# Altium schematic sheet PicoHAL - w5500.SchDoc: RP2040 CNC
size C; Author: AM; CompanyName: Expatria Technologies; DrawnBy: A.Marles; Engineer: AM; Organization: Expatria Technolgoies; Address1: Schematic; DocumentNumber: 2; SheetNumber: 2; SheetTotal: 8
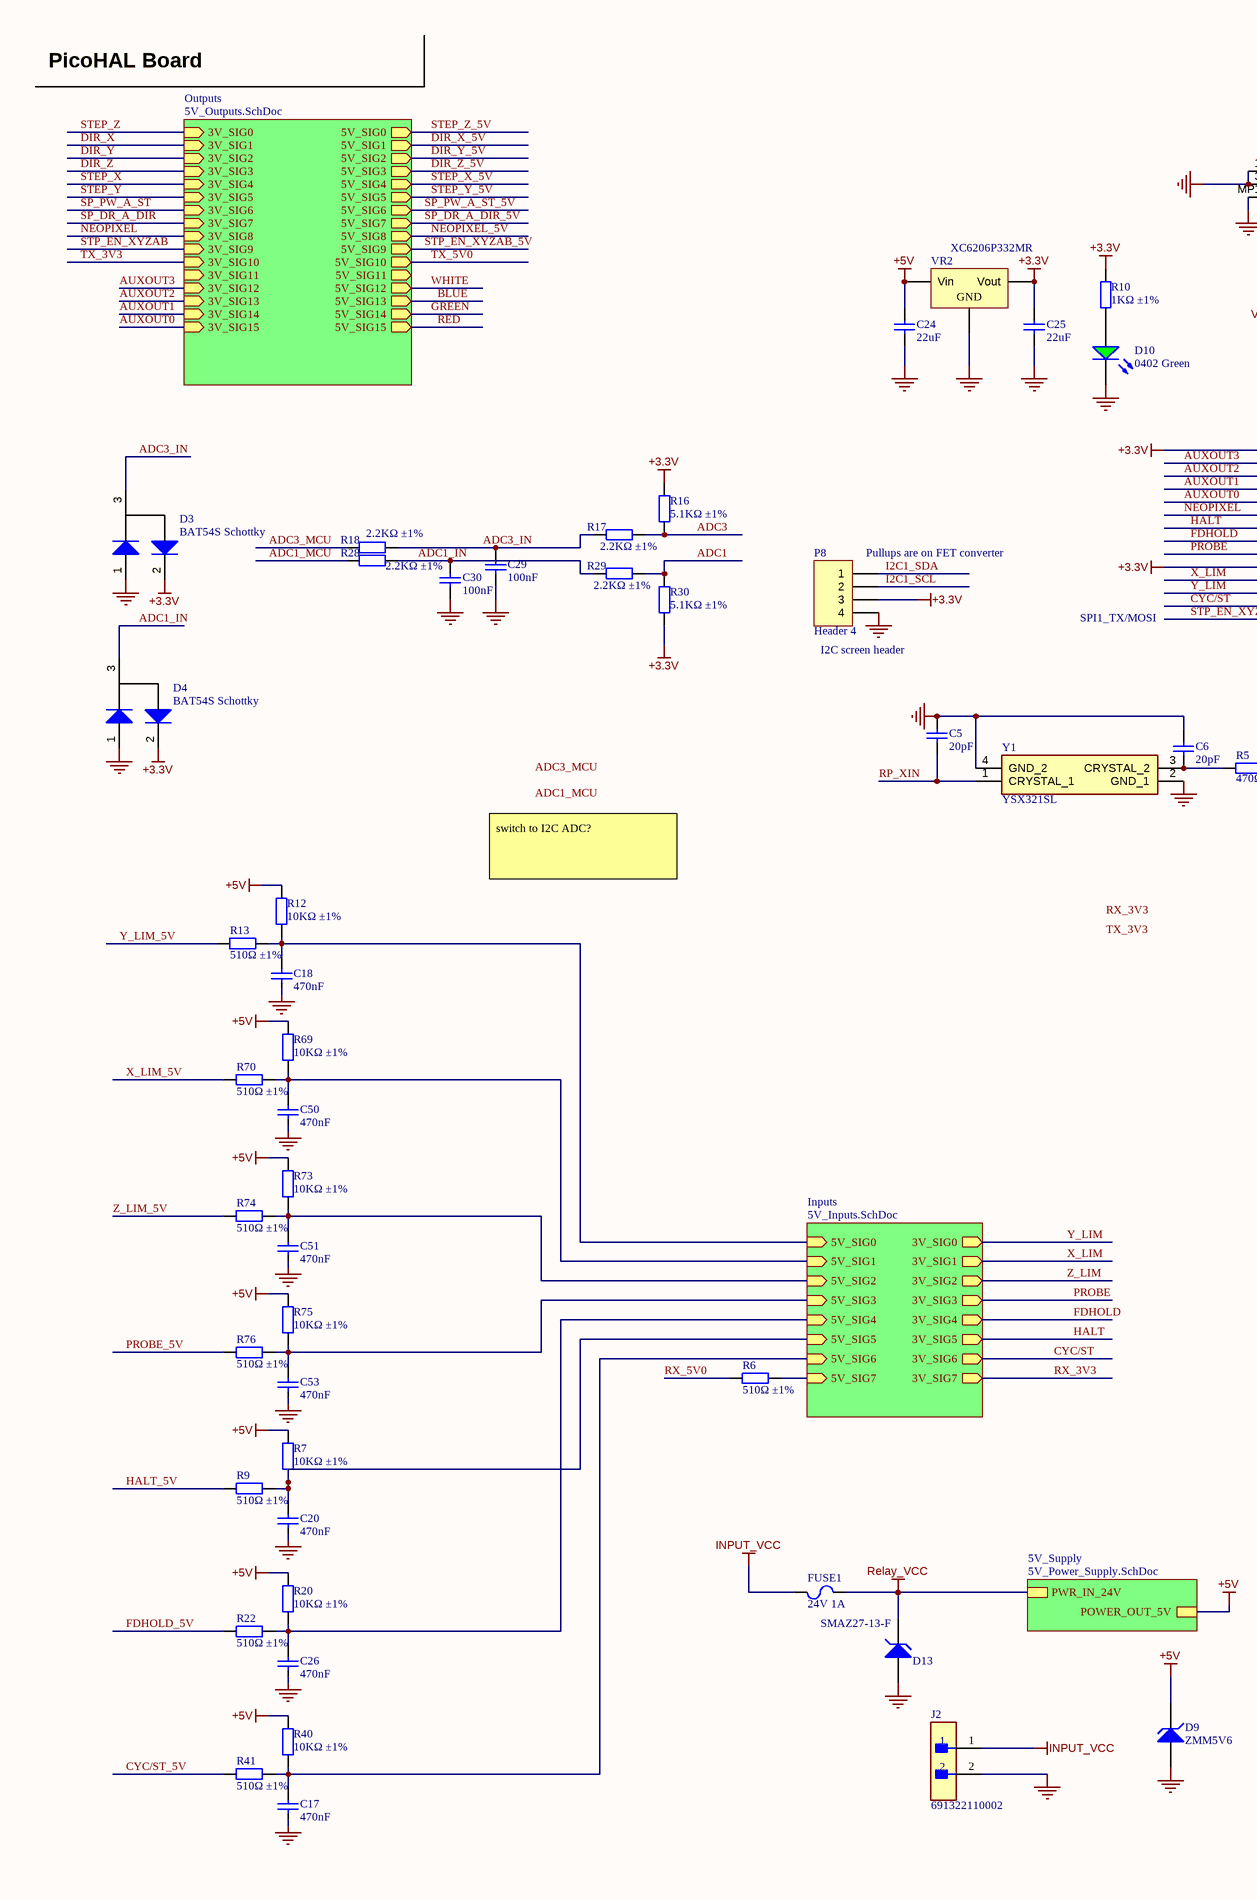
[diagram p0: PicoHAL - w5500.SchDoc, left]
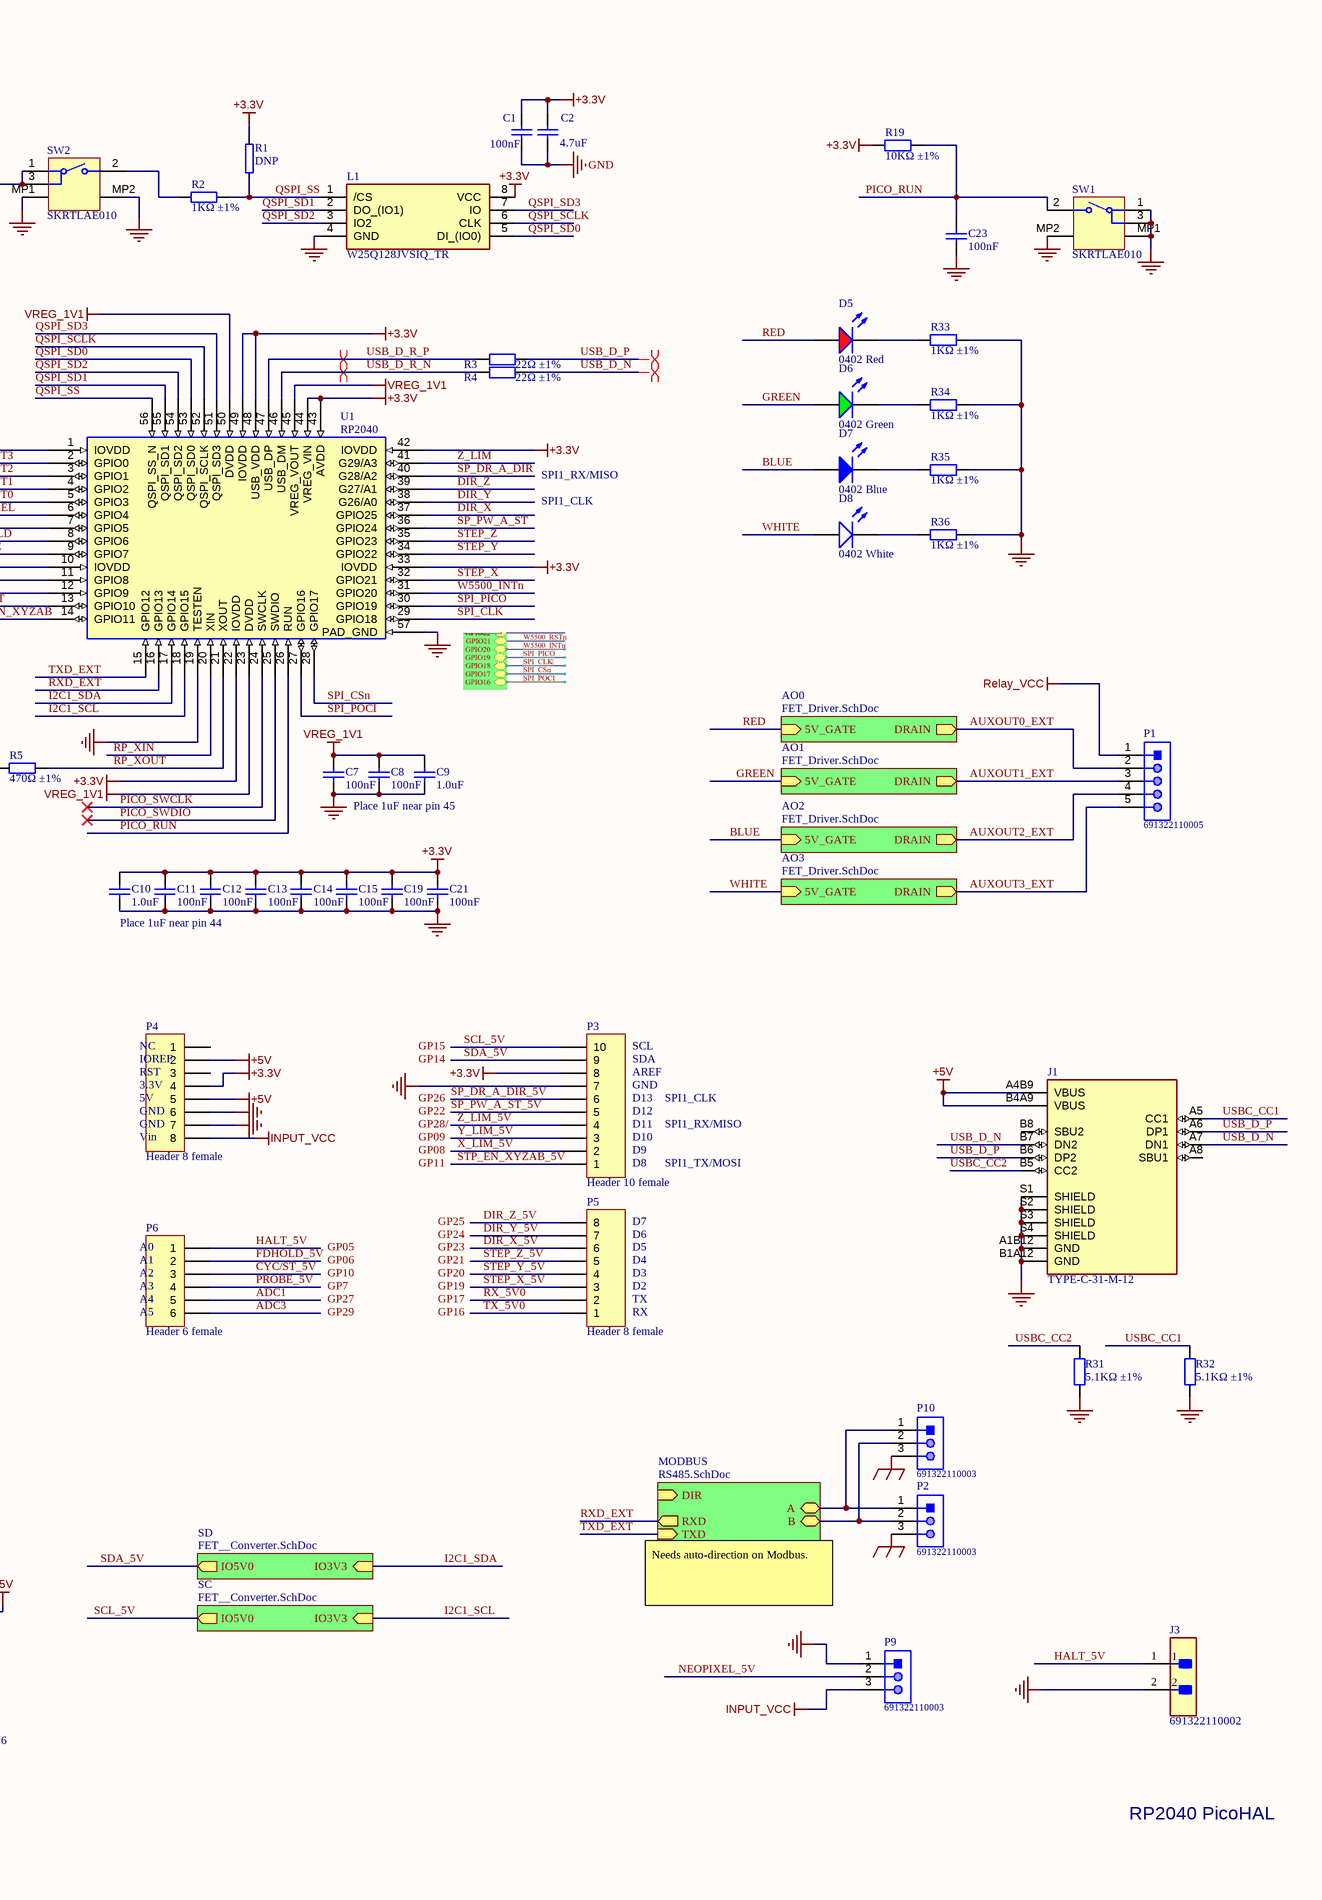
[diagram p1: PicoHAL - w5500.SchDoc, right]

## Parts
C1  100nF  [0402_C]
C2  4.7uF  [0402_C]
C5  20pF  [0402_C]
C6  20pF  [0402_C]
C7  100nF  [0402_C]
C8  100nF  [0402_C]
C9  1.0uF  [0402_C]
C10  1.0uF  [0402_C]
C11  100nF  [0402_C]
C12  100nF  [0402_C]
C13  100nF  [0402_C]
C14  100nF  [0402_C]
C15  100nF  [0402_C]
C17  470nF  [0402_C]
C18  470nF  [0402_C]
C19  100nF  [0402_C]
C20  470nF  [0402_C]
C21  100nF  [0402_C]
C23  100nF  [0402_C]
C24  22uF  [0805_C]
C25  22uF  [0805_C]
C26  470nF  [0402_C]
C29  100nF  [0402_C]
C30  100nF  [0402_C]
C50  470nF  [0402_C]
C51  470nF  [0402_C]
C53  470nF  [0402_C]
D3  BAT54S Schottky  [SOT-23(SOT-23-3)]
D4  BAT54S Schottky  [SOT-23(SOT-23-3)]
D5  0402 Red  [LED 0402_1005 RED]
D6  0402 Green  [LED 0402_1005 RED]
D7  0402 Blue  [LED 0402_1005 RED]
D8  0402 White  [LED 0402_1005 RED]
D9  ZMM5V6  [LL-34]
D10  0402 Green  [LED 0402_1005 RED]
D13  SMAZ27-13-F  [DIOM5226X240N]
FUSE1  24V 1A  [1206_C]
J1  TYPE-C-31-M-12  [HRO_TYPE-C-31-M-12]
J2  691322110002  [FP-691322110002-MFG]
J3  691322110002  [FP-691322110002-MFG]
L1  W25Q128JVSIQ_TR  [SOIC127P780X195-8N]
P1  691322110005  [691322110005]
P2  691322110003  [691322110003]
P3  Header 10 female  [HDR1X10]
P4  Header 8 female  [HDR1X8]
P5  Header 8 female  [HDR1X8]
P6  Header 6 female  [HDR1X6]
P8  Header 4  [HDR1X4]
P9  691322110003  [691322110003]
P10  691322110003  [691322110003]
R1  DNP  [0402]
R2  1KΩ ±1%  [0402_R]
R3  22Ω ±1%  [0402_R]
R4  22Ω ±1%  [0402_R]
R5  470Ω ±1%  [0402_R]
R6  510Ω ±1%  [0402_R]
R7  10KΩ ±1%  [0402_R]
R9  510Ω ±1%  [0402_R]
R10  1KΩ ±1%  [0402_R]
R12  10KΩ ±1%  [0402_R]
R13  510Ω ±1%  [0402_R]
R16  5.1KΩ ±1%  [0402_R]
R17  2.2KΩ ±1%  [0402_R]
R18  2.2KΩ ±1%  [0402_R]
R19  10KΩ ±1%  [0402_R]
R20  10KΩ ±1%  [0402_R]
R22  510Ω ±1%  [0402_R]
R28  2.2KΩ ±1%  [0402_R]
R29  2.2KΩ ±1%  [0402_R]
R30  5.1KΩ ±1%  [0402_R]
R31  5.1KΩ ±1%  [0402_R]
R32  5.1KΩ ±1%  [0402_R]
R33  1KΩ ±1%  [0402_R]
R34  1KΩ ±1%  [0402_R]
R35  1KΩ ±1%  [0402_R]
R36  1KΩ ±1%  [0402_R]
R40  10KΩ ±1%  [0402_R]
R41  510Ω ±1%  [0402_R]
R69  10KΩ ±1%  [0402_R]
R70  510Ω ±1%  [0402_R]
R73  10KΩ ±1%  [0402_R]
R74  510Ω ±1%  [0402_R]
R75  10KΩ ±1%  [0402_R]
R76  510Ω ±1%  [0402_R]
SW1  SKRTLAE010  [ALPS-SKRTLAE010_V]
SW2  SKRTLAE010  [ALPS-SKRTLAE010_V]
U1  RP2040  [RP2040]
VR2  XC6206P332MR  [SOT-23-3L]
Y1  YSX321SL  [YSX321SL]

## Sub-sheets
5V_Supply = 5V_Power_Supply.SchDoc: POWER_OUT_5V, PWR_IN_24V
AO0 = FET_Driver.SchDoc: DRAIN (out), 5V_GATE (in)
AO1 = FET_Driver.SchDoc: DRAIN (out), 5V_GATE (in)
AO2 = FET_Driver.SchDoc: DRAIN (out), 5V_GATE (in)
AO3 = FET_Driver.SchDoc: DRAIN (out), 5V_GATE (in)
Inputs = 5V_Inputs.SchDoc: 5V_SIG5 (in), 5V_SIG1 (in), 3V_SIG3 (out), 3V_SIG6 (out), 3V_SIG1 (out), 5V_SIG6 (in), 3V_SIG0 (out), 3V_SIG5 (out), 3V_SIG2 (out), 3V_SIG4 (out), 5V_SIG3 (in), 3V_SIG7 (out), 5V_SIG2 (in), 5V_SIG4 (in), 5V_SIG0 (in), 5V_SIG7 (in)
MODBUS = RS485.SchDoc: A (bidir), B (bidir), RXD (out), TXD (in), DIR (in)
Outputs = 5V_Outputs.SchDoc: 3V_SIG0 (in), 3V_SIG2 (in), 3V_SIG5 (in), 5V_SIG0 (out), 5V_SIG3 (out), 5V_SIG4 (out), 3V_SIG4 (in), 3V_SIG11 (in), 5V_SIG9 (out), 5V_SIG6 (out), 5V_SIG2 (out), 5V_SIG1 (out), 5V_SIG11 (out), 3V_SIG1 (in), 3V_SIG3 (in), 3V_SIG8 (in), 3V_SIG9 (in), 5V_SIG10 (out), 3V_SIG6 (in), 5V_SIG8 (out), 3V_SIG10 (in), 5V_SIG7 (out), 5V_SIG5 (out), 3V_SIG7 (in), 3V_SIG12 (in), 3V_SIG15 (in), 5V_SIG13 (out), 5V_SIG14 (out), 3V_SIG13 (in), 5V_SIG12 (out), 5V_SIG15 (out), 3V_SIG14 (in)
SC = FET__Converter.SchDoc: IO5V0 (out), IO3V3 (in)
SD = FET__Converter.SchDoc: IO5V0 (out), IO3V3 (in)

## Nets
+3.3V: C1.2 C2.2 C10.2 C11.2 C12.2 C13.2 C14.2 C15.2 C19.2 C21.2 C25.2 D3.2(A) D4.2(A) L1.8(VCC) P3.8 P4.4 P8.3 R1.2 R10.2 R16.1 R19.2 R30.2 U1.1(IOVDD) U1.10(IOVDD) U1.22(IOVDD) U1.33(IOVDD) U1.42(IOVDD) U1.43(AVDD) U1.44(VREG_VIN) U1.48(USB_VDD) U1.49(IOVDD) VR2.2(Vout)
+5V: C24.2 D9.2(K) J1.A4B9(VBUS) J1.B4A9(VBUS) P4.2 P4.5 R7.2 R12.2 R20.2 R40.2 R69.2 R73.2 R75.2 VR2.3(Vin) ; sheet 5V_Supply/POWER_OUT_5V
GND: C1.1 C2.1 C5.2 C6.2 C7.1 C8.1 C9.1 C10.1 C11.1 C12.1 C13.1 C14.1 C15.1 C17.1 C18.1 C19.1 C20.1 C21.1 C23.1 C24.1 C25.1 C26.1 C29.1 C30.1 C50.1 C51.1 C53.1 D3.1(A) D4.1(A) D9.1(A) D10.K D13.1(A) J1.A1B12(GND) J1.B1A12(GND) J1.S1(SHIELD) J1.S2(SHIELD) J1.S3(SHIELD) J1.S4(SHIELD) J2.2 J3.2 L1.4(GND) P3.7 P4.6 P4.7 P8.4 P9.1 R31.2 R32.2 R33.2 R34.2 R35.2 R36.2 SW1.1 SW1.3 SW1.MP1 SW1.MP2 SW2.1 SW2.3 SW2.MP1 SW2.MP2 U1.19(TESTEN) U1.57(PAD_GND) VR2.1(GND) Y1.2(GND_1) Y1.4(GND_2)
INPUT_VCC: FUSE1.1 J2.1 P4.8 P9.3
MOD_GND: P2.3 P10.3
Relay_VCC: D13.2(K) FUSE1.2 P1.1 ; sheet 5V_Supply/PWR_IN_24V
VREG_1V1: C7.2 C8.2 C9.2 U1.23(DVDD) U1.45(VREG_VOUT) U1.50(DVDD)
ADC1: P6.5 R29.2 R30.1
ADC1_IN: C30.2 D4.3(K) R28.2 R29.1
ADC1_MCU: R28.1
ADC3: P6.6 R16.2 R17.2
ADC3_IN: C29.2 D3.3(K) R17.1 R18.2
ADC3_MCU: R18.1
AUXOUT0: U1.5(GPIO3) ; sheet Outputs/3V_SIG15
AUXOUT0_EXT: P1.2 ; sheet AO0/DRAIN
AUXOUT1: U1.4(GPIO2) ; sheet Outputs/3V_SIG14
AUXOUT1_EXT: P1.3 ; sheet AO1/DRAIN
AUXOUT2: U1.3(GPIO1) ; sheet Outputs/3V_SIG13
AUXOUT2_EXT: P1.4 ; sheet AO2/DRAIN
AUXOUT3: U1.2(GPIO0) ; sheet Outputs/3V_SIG12
AUXOUT3_EXT: P1.5 ; sheet AO3/DRAIN
BLUE: D7.A ; sheet Outputs/5V_SIG13, sheet AO2/5V_GATE
CYC/ST: U1.13(GPIO10) ; sheet Inputs/3V_SIG6
CYC/ST_5V: P6.3 R41.1
DIR_X: U1.37(GPIO25) ; sheet Outputs/3V_SIG1
DIR_X_5V: P5.6 ; sheet Outputs/5V_SIG1
DIR_Y: U1.38(G26/A0) ; sheet Outputs/3V_SIG2
DIR_Y_5V: P5.7 ; sheet Outputs/5V_SIG2
DIR_Z: U1.39(G27/A1) ; sheet Outputs/3V_SIG3
DIR_Z_5V: P5.8 ; sheet Outputs/5V_SIG3
FDHOLD: U1.8(GPIO6) ; sheet Inputs/3V_SIG4
FDHOLD_5V: P6.2 R22.1
GREEN: D6.A ; sheet Outputs/5V_SIG14, sheet AO1/5V_GATE
HALT: U1.7(GPIO5) ; sheet Inputs/3V_SIG5
HALT_5V: J3.1 P6.1 R9.1
I2C1_SCL: P8.2 U1.18(GPIO15) ; sheet SC/IO3V3
I2C1_SDA: P8.1 U1.17(GPIO14) ; sheet SD/IO3V3
NEOPIXEL: U1.6(GPIO4) ; sheet Outputs/3V_SIG8
NEOPIXEL_5V: P9.2 ; sheet Outputs/5V_SIG8
PICO_RUN: C23.2 R19.1 SW1.2 U1.26(RUN)
PICO_SWCLK: U1.24(SWCLK)
PICO_SWDIO: U1.25(SWDIO)
PROBE: U1.9(GPIO7) ; sheet Inputs/3V_SIG3
PROBE_5V: P6.4 R76.1
QSPI_SCLK: L1.6(CLK) U1.52(QSPI_SCLK)
QSPI_SD0: L1.5(DI_(IO0)) U1.53(QSPI_SD0)
QSPI_SD1: L1.2(DO_(IO1)) U1.55(QSPI_SD1)
QSPI_SD2: L1.3(IO2) U1.54(QSPI_SD2)
QSPI_SD3: L1.7(IO) U1.51(QSPI_SD3)
QSPI_SS: L1.1(/CS) R1.1 R2.2 U1.56(QSPI_SS_N)
RED: D5.A ; sheet AO0/5V_GATE, sheet Outputs/5V_SIG15
RP_XIN: C5.1 U1.20(XIN) Y1.1(CRYSTAL_1)
RP_XOUT: R5.2 U1.21(XOUT)
RX_3V3: sheet Inputs/3V_SIG7
RX_5V0: P5.2 R6.1
RXD_EXT: U1.16(GPIO13) ; sheet MODBUS/RXD
SCL_5V: P3.10 ; sheet SC/IO5V0
SDA_5V: P3.9 ; sheet SD/IO5V0
SP_DR_A_DIR: U1.40(G28/A2) ; sheet Outputs/3V_SIG7
SP_DR_A_DIR_5V: P3.6 ; sheet Outputs/5V_SIG7
SP_PW_A_ST: U1.36(GPIO24) ; sheet Outputs/3V_SIG6
SP_PW_A_ST_5V: P3.5 ; sheet Outputs/5V_SIG6
SPI_CLK: U1.29(GPIO18)
SPI_CSn: U1.28(GPIO17)
SPI_PICO: U1.30(GPIO19)
SPI_POCI: U1.27(GPIO16)
STEP_X: U1.32(GPIO21) ; sheet Outputs/3V_SIG4
STEP_X_5V: P5.3 ; sheet Outputs/5V_SIG4
STEP_Y: U1.34(GPIO22) ; sheet Outputs/3V_SIG5
STEP_Y_5V: P5.4 ; sheet Outputs/5V_SIG5
STEP_Z: U1.35(GPIO23) ; sheet Outputs/3V_SIG0
STEP_Z_5V: P5.5 ; sheet Outputs/5V_SIG0
STP_EN_XYZAB: U1.14(GPIO11) ; sheet Outputs/3V_SIG9
STP_EN_XYZAB_5V: P3.1 ; sheet Outputs/5V_SIG9
TX_3V3: sheet Outputs/3V_SIG10
TX_5V0: P5.1 ; sheet Outputs/5V_SIG10
TXD_EXT: U1.15(GPIO12) ; sheet MODBUS/TXD
USB_D_N: J1.A7(DN1) J1.B7(DN2) R4.1
USB_D_P: J1.A6(DP1) J1.B6(DP2) R3.1
USB_D_R_N: R4.2 U1.46(USB_DM)
USB_D_R_P: R3.2 U1.47(USB_DP)
USBC_CC1: J1.A5(CC1) R32.1
USBC_CC2: J1.B5(CC2) R31.1
W5500_INTn: U1.31(GPIO20)
WHITE: D8.A ; sheet Outputs/5V_SIG12, sheet AO3/5V_GATE
X_LIM: U1.11(GPIO8) ; sheet Inputs/3V_SIG1
X_LIM_5V: P3.2 R70.1
Y_LIM: U1.12(GPIO9) ; sheet Inputs/3V_SIG0
Y_LIM_5V: P3.3 R13.1
Z_LIM: U1.41(G29/A3) ; sheet Inputs/3V_SIG2
Z_LIM_5V: P3.4 R74.1
NetC6_1: C6.1 R5.1 Y1.3(CRYSTAL_2)
NetC17_2: C17.2 R40.1 R41.2 ; sheet Inputs/5V_SIG6
NetC18_2: C18.2 R12.1 R13.2 ; sheet Inputs/5V_SIG0
NetC20_2: C20.2 R7.1 R9.2 ; sheet Inputs/5V_SIG5
NetC26_2: C26.2 R20.1 R22.2 ; sheet Inputs/5V_SIG4
NetC50_2: C50.2 R69.1 R70.2 ; sheet Inputs/5V_SIG1
NetC51_2: C51.2 R73.1 R74.2 ; sheet Inputs/5V_SIG2
NetC53_2: C53.2 R75.1 R76.2 ; sheet Inputs/5V_SIG3
NetD5_K: D5.K R33.1
NetD6_K: D6.K R34.1
NetD7_K: D7.K R35.1
NetD8_K: D8.K R36.1
NetD10_A: D10.A R10.1
NetP2_1: P2.1 P10.1 ; sheet MODBUS/A
NetP2_2: P2.2 P10.2 ; sheet MODBUS/B
NetR2_1: R2.1 SW2.2
NetR6_2: R6.2 ; sheet Inputs/5V_SIG7

Not connected (* = marked no-connect by the designer): J1 A8(SBU1) B8(SBU2); P4 1 3

## Layout directives
differential pair: USB_D_N, USB_D_P, USB_D_R_N, USB_D_R_P

## Notes on the sheet
- PicoHAL Board
- SPI1_CLK
- SPI1_RX/MISO
- (near P8) Pullups are on FET converter
- (near P8) I2C screen header
- SPI1_TX/MOSI
- Place 1uF near pin 45
- switch to I2C ADC?
- Place 1uF near pin 44
- (near P4) NC
- (near P4) IOREF
- GP15
- GP14
- (near P3) SDA
- (near P3) SCL
- (near P4) RST
- (near P4) 3.3V
- (near P4) 5V
- (near P4) GND
- GP26
- GP22
- (near P3) AREF
- (near P3) GND
- (near P3) D13
- (near P3) D12
- (near P4) Vin
- GP28/
- GP09
- GP08
- GP11
- (near P3) D11
- (near P3) D10
- (near P3) D9
- D8
- (near P6) A0
- GP05
- GP25
- GP24
- GP23
- D7
- (near P5) D6
- (near P5) D5
- (near P6) A1
- (near P6) A2
- (near P6) A3
- (near P6) A4
- (near P6) A5
- GP06
- GP10
- GP7
- GP27
- GP29
- GP21
- GP20
- GP19
- GP17
- GP16
- (near P5) D4
- (near P5) D3
- (near P5) D2
- (near P5) TX
- (near P5) RX
- Needs auto-direction on Modbus.
- RP2040 PicoHAL
- Labels drawn without touching a wire or pin: ADC1_MCU, ADC3_MCU, RX_3V3, TX_3V3
- Expatria Technologies
- SHEET
- PROJECT
- REV
- 1136 Glade Court
- Port Coquitlam, BC V3B 1R5
- EMAIL: INFO@EXPATRIA.CA
- SIZE
- ENGR
- C
- MODIFIED
- DOCUMENT
- /
- Copyright Expatria Technologies 2023. This document describes Open Hardware and is licensed under the CERN-OHL-S v2. No warranty is implied or expressed.

## Library data of the parts
C1 C7 C8 C11-C15 C19 C21 C23 C29 C30 = 0402 100nF (104) 10% 16V: Chip capacitors; Manufacturer: Samsung Electro-Mechanics; PartNumber: CL05B104KO5NNNC; Tolerance: 10%; Voltage: 16V; ComponentLink1Description: Supplier link; ComponentLink1URL: http://www.szlcsc.com/product/details_1877.html; Package: 0402; Supplier: LC; SuppliersPartNumber: C1525; Capacitance: 100nF
C2 = 0402 4.7uF (475) 20% 10V: Chip capacitor; Manufacturer: Samsung Electro-Mechanics; PartNumber: CL05A475MP5NRNC; Tolerance: 20%; Voltage: 10V; ComponentLink1Description: Supplier link; ComponentLink1URL: http://www.szlcsc.com/product/details_24469.html; Package: 0402; Supplier: LC; SuppliersPartNumber: C23733; Capacitance: 4.7uF
C5 C6 = 0402 20pF (200) 5% 50V: Chip capacitors; Manufacturer: Guangdong Fenghua Advanced Tech; PartNumber: 0402CG200J500NT; Tolerance: 5%; Voltage: 50V; ComponentLink1Description: Supplier link; ComponentLink1URL: http://www.szlcsc.com/product/details_1906.html; Package: 0402; Supplier: LC; SuppliersPartNumber: C1554; Capacitance: 20pF
C9 C10 = 0402 1.0uF (105) 10% 25V: Chip capacitor; Manufacturer: Samsung Electro-Mechanics; PartNumber: CL05A105KA5NQNC; Capacitance: 1uF; Tolerance: 10%; Voltage: 25V; ComponentLink1Description: Supplier link; ComponentLink1URL: http://www.szlcsc.com/product/details_53938.html; Package: 0402; Supplier: LC; SuppliersPartNumber: C52923
C17 C18 C20 C26 C50 C51 C53 = 0402 470nF (474) 10% 10V: Chip capacitors; Manufacturer: Samsung Electro-Mechanics; PartNumber: CL05A474KP5NNNC; Tolerance: 10%; Voltage: 10V; ComponentLink1Description: Supplier link; ComponentLink1URL: http://www.szlcsc.com/product/details_48344.html; Package: 0402; Supplier: LC; SuppliersPartNumber: C47339; Capacitance: 470nF
C24 C25 = 0805 22uF (226) 20% 25V: Chip capacitors; Manufacturer: Samsung Electro-Mechanics; PartNumber: CL21A226MAQNNNE; Tolerance: 20%; Voltage: 25V; Package: 0805; Supplier: LC; SuppliersPartNumber: C2922481; Capacitance: 22uF; ComponentLink1Description: Supplier link; ComponentLink1URL: http://www.szlcsc.com/product/details_46786.html
D3 D4 = SOT-23 BAT54S: 30V Dual 200mA 800mV@100mA SOT-23 Schottky Barrier Diodes (SBD) ROHS; ComponentLink1Description: 供应商链接; ComponentLink1URL: http://www.szlcsc.com/product/details_2877.html; Package: SOT-23; Supplier: LC; SuppliersPartNumber: C916425
D5 = 0402 LED Red: LED; Package: 0402; Supplier: LC; SuppliersPartNumber: C130720; Color: Red
D6 D10 = 0402 LED Green: LED; Package: 0402; Supplier: LC; SuppliersPartNumber: C130723; Color: Green
D7 = 0402 LED Blue: LED; Package: 0402; Supplier: LC; SuppliersPartNumber: C130724; Color: Blue
D8 = 0402 LED White: LED; Package: 0402; Supplier: LC; SuppliersPartNumber: C130725; Color: White
D9 = LL-34 ZMM5V6: 500mW - 0.1uA @ 1V 5.6V LL-34 Zener Diodes ROHS; ComponentLink1Description: 供应商链接; ComponentLink1URL: http://www.szlcsc.com/product/details_8541.html; Package: LL-34; Supplier: LC; SuppliersPartNumber: C8062
D13 = BZT52C27: 27V ±5% 1W 500nA @ 20.5V SMA(DO-214AC) Zener Diodes RoHS; ComponentLink1Description: 供应商链接; ComponentLink1URL: http://www.szlcsc.com/product/details_8541.html; Package: SMA(DO-214AC); Supplier: LC; SuppliersPartNumber: C155318
FUSE1 = JK-nSMD050-24: 24V 1A 0.1s 1206 PTC Resettable Fuses RoHS; Manufacturer: Jinrui Electronic Materials Co.; Package: 1206; Supplier: LC; SuppliersPartNumber: C369160; PartNumber: JK-nSMD050-24
J1 = TYPE-C-31-M-12: USB Connectors 24 Receptacle 1 8.94*7.3mm RoHS; MF: HRO Electronics Co., Ltd.; Value: *; SnapEDA_Link: https://www.snapeda.com/parts/TYPE-C-31-M-12/HRO%20Electronics%20Co.,%20Ltd./view-part/3228496/?ref=snap; Package: Package; MP: TYPE-C-31-M-12; Price: None; Availability: Unavailable; SuppliersPartNumber: C165948
J2 J3 = CMP-1502-01791-2: TERM BLOCK HDR 2POS 90DEG 3.5MM; Voltage: 300V; Current: 10A; Number of Levels: 1; Number of Positions: 2; Length: 10.5mm; Pitch: 3.5mm; Color: Green; Mount: Through Hole; Package Quantity: 1000; Series: WR-TBL Series 3221; Contact Material: Brass; RoHS Compliant: Yes; Width: 8.1mm; Housing Material: Nylon; Flammability Rating: UL94 V-0; Lead Free: Lead Free; Termination: Solder; Number of Contacts: 2; Packaging: Bulk; Number of Rows: 1; Height: 9.2mm; Number of Positions Per Level: 2
  J2: SuppliersPartNumber: C395830
L1 = W25Q128JVSIQ_TR: Inductor; Manufacturer_Name: Winbond; Manufacturer_Part_Number: W25Q128JVSIQ TR; Datasheet Link: http://www.winbond.com/resource-files/w25q128jv%20spi%20revc%2011162016.pdf; Height: 1.95mm; Mouser Part Number: 454-W25Q128JVSIQTR; Mouser Price/Stock: https://www.mouser.co.uk/ProductDetail/Winbond/W25Q128JVSIQ-TR?qs=qSfuJ%252Bfl%2Fd7vTyLA9kNdGw%3D%3D; Arrow Part Number: W25Q128JVSIQ TR; Arrow Price/Stock: https://www.arrow.com/en/products/w25q128jvsiqtr/winbond-electronics?region=nac; SuppliersPartNumber: C97521
P1 = CMP-1502-01794-1: Serie 3221 - 3.50mm Horizontal PCB Header WR-TBL, 5 pin; Manufacturer: Wurth Elektronik; Pin Number: 5; Gender: Male; Manufacturer URL: http://www.we-online.de; Pitch: 3.50mm; Package Reference: 691322110005; Part Number: 691322110005; Publisher: WurthElektronik; Datasheet URL: http://katalog.we-online.de/em/datasheet/6913221100xx.pdf; Operating Temperature: -40to105degC; Mounting Technology: THT; Packaging: Box; SuppliersPartNumber: C430553
P2 P9 P10 = CMP-1502-01792-1: Serie 3221 - 3.50mm Horizontal PCB Header WR-TBL, 3 pin; Manufacturer: Wurth Elektronik; Pin Number: 3; Gender: Male; Part Number: 691322110003; Pitch: 3.50mm; Manufacturer URL: http://www.we-online.de; Packaging: Box; Operating Temperature: -40to105degC; Datasheet URL: http://katalog.we-online.de/em/datasheet/6913221100xx.pdf; Publisher: WurthElektronik; Mounting Technology: THT; Package Reference: 691322110003; SuppliersPartNumber: C430551
P3 = Header 10: Header, 10-Pin; LatestRevisionDate: 17-Jul-2002; LatestRevisionNote: Re-released for DXP Platform.; Publisher: Altium Limited; SuppliersPartNumber: C2905418
P4 P5 = Header 8: Header, 8-Pin; LatestRevisionDate: 17-Jul-2002; LatestRevisionNote: Re-released for DXP Platform.; Publisher: Altium Limited; SuppliersPartNumber: C27438
P6 = Header 6: Header, 6-Pin; LatestRevisionDate: 17-Jul-2002; LatestRevisionNote: Re-released for DXP Platform.; Publisher: Altium Limited; SuppliersPartNumber: C40877
P8 = Header 4: Header, 4-Pin F; Publisher: Altium Limited; SuppliersPartNumber: C541851
R1 = RES: Resistor, ±5%, 0.05W; Part Number: R0201-0R; Part number IPS: 00000003245; Value: 0R; Note: Chip Res 5%; Artikkelnr Noca: N.A.; Manufacturer: *; Manufacturer Part Number: *; ComponentLink1URL: *; ComponentLink1Description: Datasheet; ComponentLink2URL: *; ComponentLink2Description: Supplier link; HelpURL: *; Footprint Doc: 0201; LatestRevisionDate: 2017-11-09; Pin Count: 2; Publisher: Nordic Semiconductor; Published: 2014-11-13; Supplier 1: *; Supplier Part Number 1: *; Supplier 2: *; Supplier Part Number 2: *
R2 R10 R33-R36 = 0402 1K (1001) 1%: Chip resistor; Manufacturer: Uniroyal Elec; PartNumber: 0402WGF1001TCE; Power: 1/16W; ComponentLink1Description: Supplier link; ComponentLink1URL: http://www.szlcsc.com/product/details_12256.html; Package: 0402; Supplier: LC; SuppliersPartNumber: C11702; Resistance: 1KΩ; Tolerance: 1%
R3 R4 = 0402 22R (22R0) 1%: Chip resistor; Manufacturer: Uniroyal Elec; PartNumber: 0402WGF220JTCE; Power: 1/16W; ComponentLink1Description: Supplier link; ComponentLink1URL: http://www.szlcsc.com/product/details_25835.html; Package: 0402; Supplier: LC; SuppliersPartNumber: C25092; Resistance: 22Ω; Tolerance: 1%
R5 = 0402 470R (4700) 1%: Chip resistor; Manufacturer: Uniroyal Elec; PartNumber: 0402WGF4700TCE; Power: 1/16W; ComponentLink1Description: Supplier link; ComponentLink1URL: http://www.szlcsc.com/product/details_25860.html; Package: 0402; Supplier: LC; SuppliersPartNumber: C25117; Resistance: 470Ω; Tolerance: 1%
R6 R9 R13 R22 R41 R70 R74 R76 = 0402 510R (5100) 1%: Chip resistor; Manufacturer: Uniroyal Elec; PartNumber: 0402WGF5100TCE; Power: 1/16W; ComponentLink1Description: Supplier link; ComponentLink1URL: http://www.szlcsc.com/product/details_25866.html; Package: 0402; Supplier: LC; SuppliersPartNumber: C25123; Resistance: 510Ω; Tolerance: 1%
R7 R12 R19 R20 R40 R69 R73 R75 = 0402 10K (1002) 1%: Chip resistor; Manufacturer: Uniroyal Elec; PartNumber: 0402WGF1002TCE; Power: 1/16W; ComponentLink1Description: Supplier link; ComponentLink1URL: http://www.szlcsc.com/product/details_26487.html; Package: 0402; Supplier: LC; SuppliersPartNumber: C25744; Resistance: 10KΩ; Tolerance: 1%
R16 R30-R32 = 0402 5.1K (5101) 1%: Chip resistor; Manufacturer: Uniroyal Elec; PartNumber: 0402WGF5101TCE; Power: 1/16W; Resistance: 51.1KΩ; ComponentLink1Description: Supplier link; ComponentLink1URL: http://www.szlcsc.com/product/details_26648.html; Package: 0402; Supplier: LC; SuppliersPartNumber: C25905; Tolerance: 1%
R17 R18 R28 R29 = 0402 2.2K (2201) 1%: Chip resistor; Manufacturer: Uniroyal Elec; PartNumber: 0402WGF2201TCE; Power: 1/16W; ComponentLink1Description: Supplier link; ComponentLink1URL: http://www.szlcsc.com/product/details_26622.html; Package: 0402; Supplier: LC; SuppliersPartNumber: C25879; Resistance: 2.2KΩ; Tolerance: 1%
SW1 SW2 = CMP-2000-07073-2: Side Push Type, 250 V, -40 to 90 degC, 3-Pin SMD, RoHS, Tape and Reel; Manufacturer: ALPS; Operating Force: 1.6N; Folder: Unified Components\Components\New Releases\New\; Maximum Current Rating: 0.05@12VDCA; RevisionId: 1; Pole Throw Configuration: SPST; Switch Configuration: N.O.; AccessRights: 2147483647; Maximum DC Voltage Rating: 12V; ContentType: Unified Component; Rad Hard: No; Mounting: SurfaceMount; Datasheet URL: http://www.alps.com/prod/info/E/PDF/Tact/SurfaceMount/SKRT/SKRT.PDF; Manufacturer URL: http://www.alps.com/e/; ReleaseDate: 22/09/2017 06:13:25 AM; ItemHRID: CMP-2000-07073; ContentTypeGUID: CB3C11C4-E317-11DF-B822-12313F0024A2; LifeCycle: Released; ItemGUID: EAC55BEC-37DC-4BDB-8BA7-D75E6D5C3D75; Packaging: Tape&Reel; Package Reference: SKRTLAE010; FolderGUID: B7F4506A-9127-42E7-A087-46FE7B18D116; Datasheet Version: 06/2015; Mounting Technology: SurfaceMount; LifeCycleStateGUID: 61E382EE-6656-4F12-9E24-BE9327104A25; Package Description: 3-Pin Surface Mount Device, Body 4.5 x 3.55 mm, Pitch 1.225 mm; SuppliersPartNumber: C110293
U1 = RP2040: RP2040 First MCU from RPI; SuppliersPartNumber: C2040
VR2 = SOT-23 XC6206P332MR: 200mA 680mV@(100mA) Fixed 3.3V~3.3V Positive 1 6V SOT-23-3L Linear Voltage Regulators (LDO) ROHS; ComponentLink1Description: 供应商链接; ComponentLink1URL: http://www.szlcsc.com/product/details_5896.html; Package: SOT-23; Supplier: LC; SuppliersPartNumber: C5446
Y1 = YSX321SL: Crystal or Oscillator; Manufacturer_Name: YXC; Datasheet Link: https://datasheet.lcsc.com/szlcsc/YSX321SL-30MHZ-10PF-8PPM_C70576.pdf; Height: 0.8mm; Manufacturer_Part_Number: YSX321SL; SuppliersPartNumber: C9002